# Altium schematic sheet xl6009_kian_v1_CONECTOR.SchDoc
size A; SheetNumber: 2; SheetTotal: 3
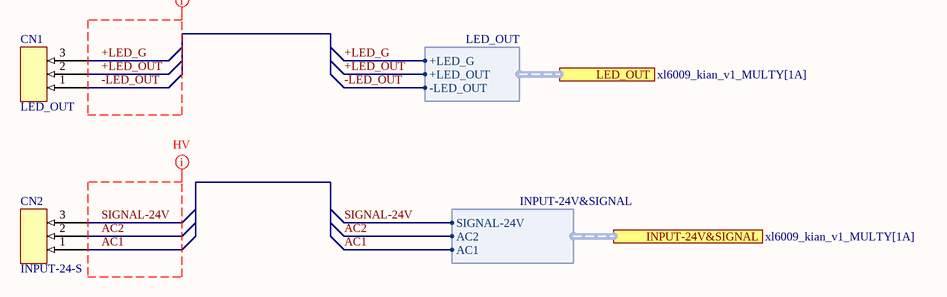
[diagram p0: xl6009_kian_v1_CONECTOR.SchDoc]

## Parts
CN1  LED_OUT  [CONECTOR/FONIX/3PIN]
CN2  INPUT-24-S  [CONECTOR/FONIX/3PIN]

## Ports
INPUT-24V&SIGNAL (harness INPUT-24V&SIGNAL, see xl6009_kian_v1_MULTY[1A]), LED_OUT (harness LED_OUT, see xl6009_kian_v1_MULTY[1A])

## Harnesses
LED_OUT: +LED_G, +LED_OUT, -LED_OUT
INPUT-24V&SIGNAL: SIGNAL-24V, AC2, AC1

## Nets
+LED_G: CN1.3 ; port LED_OUT.+LED_G
+LED_OUT: CN1.2 ; port LED_OUT.+LED_OUT
-LED_OUT: CN1.1 ; port LED_OUT.-LED_OUT
AC1: CN2.1 ; port INPUT-24V&SIGNAL.AC1
AC2: CN2.2 ; port INPUT-24V&SIGNAL.AC2
SIGNAL-24V: CN2.3 ; port INPUT-24V&SIGNAL.SIGNAL-24V

## Layout directives
net class HV: AC1, AC2, SIGNAL-24V
net class POWER_OUT: +LED_G, +LED_OUT, -LED_OUT

## Library data of the parts
CN1 CN2 = CONECTOR/FONIX/3PIN